# EAGLE schematic 909.v1 (EAGLE 6.5.0)
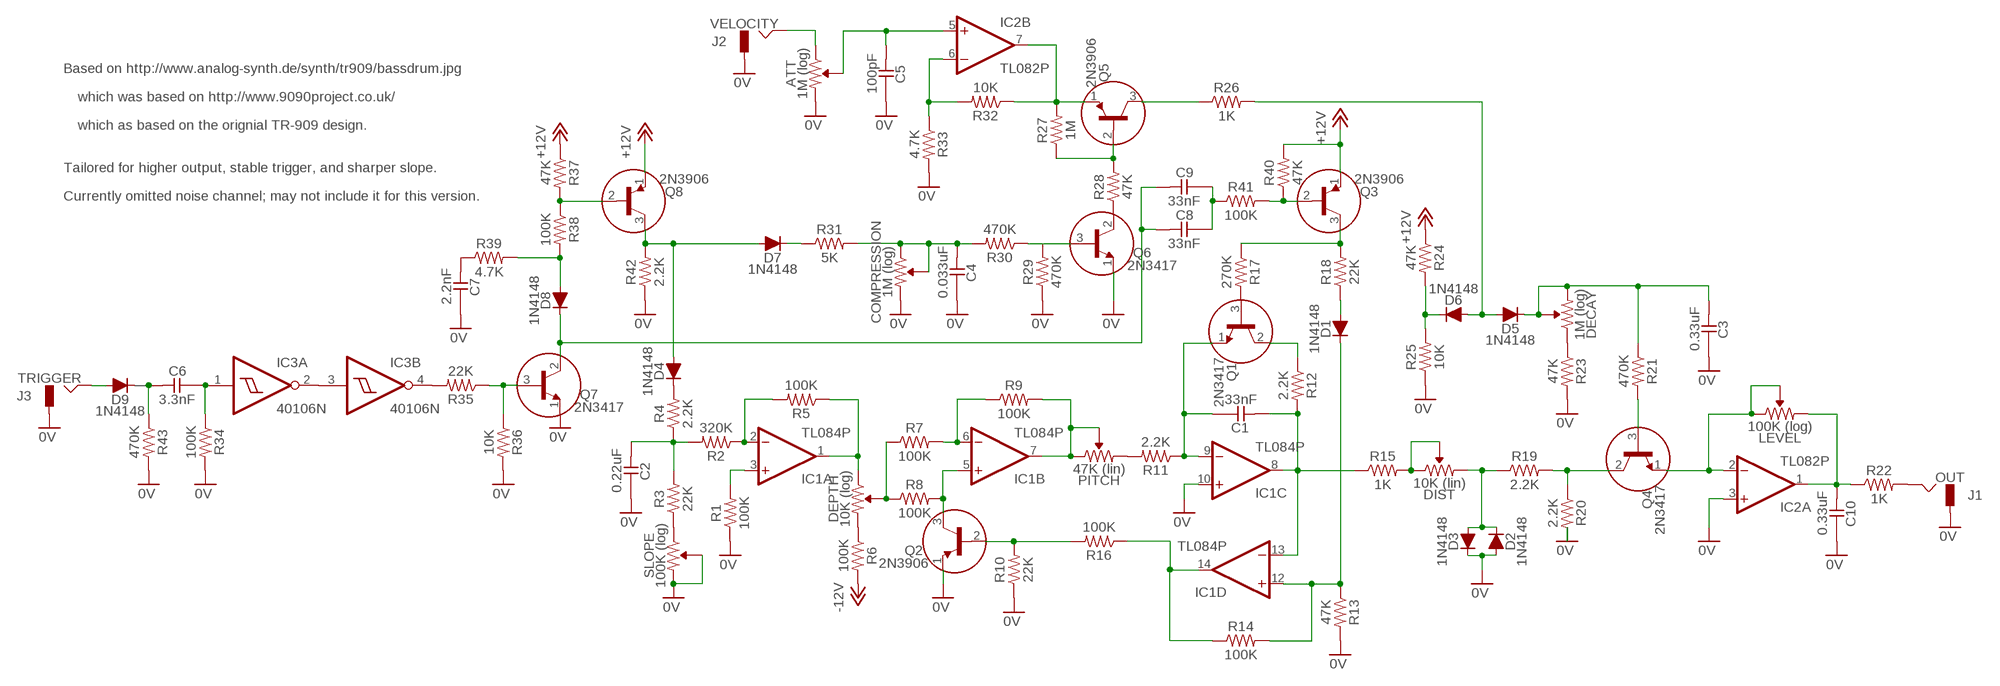
[diagram p0: schematic, sheet 1]

## Parts
ATT  1M (log)  R-VAR  [R-VAR]
C1  33nF  CC-US025-024X044  [C025-024X044]
C2  0.22uF  CC-US025-024X044  [C025-024X044]
C3  0.33uF  CC-US025-024X044  [C025-024X044]
C4  0.033uF  CC-US025-024X044  [C025-024X044]
C5  100pF  CC-US025-024X044  [C025-024X044]
C6  3.3nF  CC-US025-024X044  [C025-024X044]
C7  2.2nF  CC-US025-024X044  [C025-024X044]
C8  33nF  CC-US025-024X044  [C025-024X044]
C9  33nF  CC-US025-024X044  [C025-024X044]
C10  0.33uF  CC-US025-024X044  [C025-024X044]
COMPRESSION  1M (log)  R-VAR  [R-VAR]
D1  1N4148  [DO35-7]
D2  1N4148  [DO35-7]
D3  1N4148  [DO35-7]
D4  1N4148  [DO35-7]
D5  1N4148  [DO35-7]
D6  1N4148  [DO35-7]
D7  1N4148  [DO35-7]
D8  1N4148  [DO35-7]
D9  1N4148  [DO35-7]
DECAY  1M (log)  R-VAR  [R-VAR]
DEPTH  10K (log)  R-VAR  [R-VAR]
DIST  10K (lin)  R-VAR  [R-VAR]
IC1  TL084P  [DIL14]
IC2  TL082P  [DIL08]
IC3  40106N  [DIL14]
J1  OUT  JACK-M  [JACK-M]
J2  VELOCITY  JACK-M  [JACK-M]
J3  TRIGGER  JACK-M  [JACK-M]
LEVEL  100K (log)  R-VAR  [R-VAR]
PITCH  47K (lin)  R-VAR  [R-VAR]
Q1  2N3417  [TO92]
Q2  2N3906  [TO92]
Q3  2N3906  [TO92]
Q4  2N3417  [TO92]
Q5  2N3906  [TO92]
Q6  2N3417  [TO92]
Q7  2N3417  [TO92]
Q8  2N3906  [TO92]
R1  100K  R0309/10  [0309/10]
R2  320K  R0309/10  [0309/10]
R3  22K  R0309/10  [0309/10]
R4  2.2K  R0309/10  [0309/10]
R5  100K  R0309/10  [0309/10]
R6  100K  R0309/10  [0309/10]
R7  100K  R0309/10  [0309/10]
R8  100K  R0309/10  [0309/10]
R9  100K  R0309/10  [0309/10]
R10  22K  R0309/10  [0309/10]
R11  2.2K  R0309/10  [0309/10]
R12  2.2K  R0309/10  [0309/10]
R13  47K  R0309/10  [0309/10]
R14  100K  R0309/10  [0309/10]
R15  1K  R0309/10  [0309/10]
R16  100K  R0309/10  [0309/10]
R17  270K  R0309/10  [0309/10]
R18  22K  R0309/10  [0309/10]
R19  2.2K  R0309/10  [0309/10]
R20  2.2K  R0309/10  [0309/10]
R21  470K  R0309/10  [0309/10]
R22  1K  R0309/10  [0309/10]
R23  47K  R0309/10  [0309/10]
R24  47K  R0309/10  [0309/10]
R25  10K  R0309/10  [0309/10]
R26  1K  R0309/10  [0309/10]
R27  1M  R0309/10  [0309/10]
R28  47K  R0309/10  [0309/10]
R29  470K  R0309/10  [0309/10]
R30  470K  R0309/10  [0309/10]
R31  5K  R0309/10  [0309/10]
R32  10K  R0309/10  [0309/10]
R33  4.7K  R0309/10  [0309/10]
R34  100K  R0309/10  [0309/10]
R35  22K  R0309/10  [0309/10]
R36  10K  R0309/10  [0309/10]
R37  47K  R0309/10  [0309/10]
R38  100K  R0309/10  [0309/10]
R39  4.7K  R0309/10  [0309/10]
R40  47K  R0309/10  [0309/10]
R41  100K  R0309/10  [0309/10]
R42  2.2K  R0309/10  [0309/10]
R43  470K  R0309/10  [0309/10]
SLOPE  100K (log)  R-VAR  [R-VAR]

## Nets
0V: ATT.R2 C2.1 C3.1 C4.1 C5.1 C7.1 C10.1 COMPRESSION.R2 D2.A D3.C IC1.10(C:+IN) IC2.3(A:+IN) J1.GND J2.GND J3.GND Q2.1(E) Q6.1(E) Q7.1(E) R1.1 R10.1 R13.2 R20.2 R23.2 R25.1 R29.1 R33.2 R34.2 R36.2 R42.1 R43.2 SLOPE.R2 SLOPE.VAR
+12V: Q3.1(E) Q8.1(E) R24.1 R37.1 R40.2
-12V: R6.2
N$1: D4.C R4.2
N$2: R3.1 SLOPE.R1
N$3: IC1.2(A:-IN) R2.1 R5.2
N$4: C2.2 R2.2 R3.2 R4.1
N$5: IC1.3(A:+IN) R1.2
N$6: IC1.7(B:OUT) PITCH.R1 PITCH.VAR R9.2
N$7: DEPTH.R1 IC1.1(A:OUT) R5.1
N$8: DEPTH.R2 R6.1
N$9: IC1.6(B:-IN) R7.2 R9.1
N$10: IC1.5(B:+IN) Q2.3(C) R8.2
N$11: PITCH.R2 R11.2
N$12: DEPTH.VAR R7.1 R8.1
N$13: C1.1 IC1.9(C:-IN) Q1.1(E) R11.1
N$14: Q2.2(B) R10.2 R16.2
N$15: Q1.3(B) R17.2
N$16: Q3.3(C) R17.1 R18.2
N$17: Q1.2(C) R12.1
N$18: C1.2 IC1.8(C:OUT) IC1.13(D:-IN) R12.2 R15.1
N$19: DIST.R1 DIST.VAR R15.2
N$20: D2.C D3.A DIST.R2 R19.1
N$21: C6.2 R43.1
N$22: D1.C IC1.12(D:+IN) R13.1 R14.2
N$23: IC1.14(D:OUT) R14.1 R16.1
N$24: D1.A R18.1
N$25: D5.A D6.A R26.2
N$26: Q4.2(C) R19.2 R20.1
N$27: DECAY.R1 R23.1
N$28: IC2.2(A:-IN) LEVEL.R1 LEVEL.VAR Q4.1(E)
N$29: D9.A J3.HOT
N$30: J1.HOT R22.2
N$31: C8.2 C9.2 D8.C Q7.2(C)
N$32: D6.C R24.2 R25.2
N$33: C10.2 IC2.1(A:OUT) LEVEL.R2 R22.1
N$34: Q5.3(C) R26.1
N$35: IC2.7(B:OUT) Q5.1(E) R27.2 R32.1
N$36: Q5.2(B) R27.1 R28.2
N$37: Q6.2(C) R28.1
N$38: Q6.3(B) R29.2 R30.1
N$39: C4.2 COMPRESSION.R1 COMPRESSION.VAR R30.2 R31.2
N$40: D7.C R31.1
N$41: ATT.VAR C5.2 IC2.5(B:+IN)
N$42: IC2.6(B:-IN) R32.2 R33.1
N$43: C6.1 IC3.1(A:I) R34.1
N$44: IC3.2(A:O) IC3.3(B:I)
N$45: ATT.R1 J2.HOT
N$46: IC3.4(B:O) R35.2
N$47: Q7.3(B) R35.1 R36.1
N$48: Q8.2(B) R37.2 R38.1
N$49: D8.A R38.2 R39.2
N$50: C7.2 R39.1
N$51: C3.2 D5.C DECAY.R2 DECAY.VAR R21.1
N$52: C8.1 C9.1 R41.1
N$53: Q3.2(B) R40.1 R41.2
N$54: Q4.3(B) R21.2
N$55: D4.A D7.A Q8.3(C) R42.2
Unconnected: D9.C IC3.5(C:I) IC3.6(C:O) IC3.8(D:O) IC3.9(D:I) IC3.10(E:O) IC3.11(E:I) IC3.12(F:O) IC3.13(F:I)

## Notes on the sheet
- Based on http://www.analog-synth.de/synth/tr909/bassdrum.jpg
- which was based on http://www.9090project.co.uk/
- which as based on the orignial TR-909 design.
- Tailored for higher output, stable trigger, and sharper slope.
- Currently omitted noise channel; may not include it for this version.

## Power pins joined to a net without a drawn wire
V+: IC1.4(P:V+) IC2.8(P:V+)
V-: IC1.11(P:V-) IC2.4(P:V-)
VDD: IC3.14(P:VDD)
VSS: IC3.7(P:VSS)

## Library data of the parts
ATT COMPRESSION DECAY DEPTH DIST LEVEL PITCH SLOPE = _common:R-VAR
C1-C10 = _common:CC-US: CAPACITOR, US symbol
D1-D9 = _common:1N4148: DIODE high speed (Philips)
IC1 = _common:TL084: OP AMP
IC2 = _common:TL082: OP AMP
IC3 = 40xx:40106: Hex SCHMITT TRIGGER
J1-J3 = _common:JACK-M
Q1 Q4 Q6 Q7 = _common:2N3417: NPN Transistor
Q2 Q3 Q5 Q8 = _common:2N3906: PNP Transistor
R1-R43 = _common:R: RESISTOR, US symbol